# EAGLE schematic 7805 Voeding (EAGLE 9.7.0)
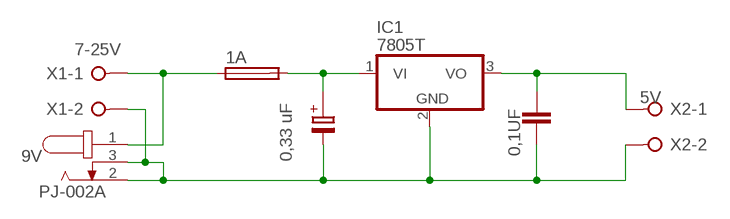
[diagram p0: schematic, sheet 1]

## Parts
1A  SH25  [SH25]
9V  PJ-002A  [CUI_PJ-002A]
C1  0,1UF  CAPACITORCERAMIC-2.54MM  [CAP-THRU-2.54MM]
C3  0,33 uF  C-PR-2,0X5  [E2,0-5]
IC1  7805T  [TO220H]
X1  7-25V  W237-02P  [W237-132]
X2  5V  W237-02P  [W237-132]

## Nets
N$1: 1A.2 C3.+ IC1.1(VI)
N$2: 9V.2 9V.3 C1.1 C3.- IC1.2(GND) X1.2 X2.2
N$4: 1A.1 9V.1 X1.1
VDD: C1.2 IC1.3(VO) X2.1

## Library data of the parts
1A = fuse:SH25: FUSE HOLDER grid 25 mm, OGN0031 8211, Schurter (Buerklin); MF: SCHURTER; MPN: 0031.8211; OC_FARNELL: 1162741; OC_NEWARK: 96B9380
9V = PJ-002A:PJ-002A: 2.0 mm Center Pin, 2.5 A, Right Angle, Through Hole, Dc Power Jack Connector; MANUFACTURER: CUI INC; STANDARD: Manufacturer recommendations
C1 = Tinkercad:CAPACITOR: Capacitor - Generic
C3 = cap-pan40:C-PR: POLARIZED ELECTROLYTIC/TANTALUM
IC1 = adafruit:78*: Positive VOLTAGE REGULATOR Added bigger pads to the TO-92 package
X1 X2 = con-wago-508:W237-02P: WAGO SREW CLAMP; OC_FARNELL: unknown; OC_NEWARK: unknown